# Altium schematic sheet MCU023_Hardware.SchDoc
size 431 x 279 mm; Date: Not shown in title block; ApprovedBy: Not shown in title block; CheckedBy: Not shown in title block; Author: Not shown in title block; CompanyName: Not shown in title block; Engineer: Not shown in title block; Organization: Not shown in title block; Address1: Not shown in title block; Address2: Not shown in title block; Address3: Not shown in title block; Address4: Not shown in title block; DocumentNumber: 1; Revision: Use project parameter SCH_Rev; SheetNumber: 6; SheetTotal: 6; PageSetup: Record=PageOptions|CenterHorizontal=True|CenterVertical=True|PrintScale=1.00|XCorrection=1.00|YCorrection=1.00|PrintKind=0|BorderSize=5000000|LeftOffset=0|BottomOffset=0|Orientation=2|PaperLength=1000|PaperWidth=1000|Scale=100|PaperSource=15|PrintQuality=600|MediaType=1|DitherType=10|PaperKind=Letter|PrintScaleMode=1; CurrentTime: Not shown in title block; CurrentDate: Not shown in title block; Time: Not shown in title block; DocumentFullPathAndName: Not shown in title block; DocumentName: Not shown in title block; ModifiedDate: Not shown in title block; ImagePath: Not shown in title block
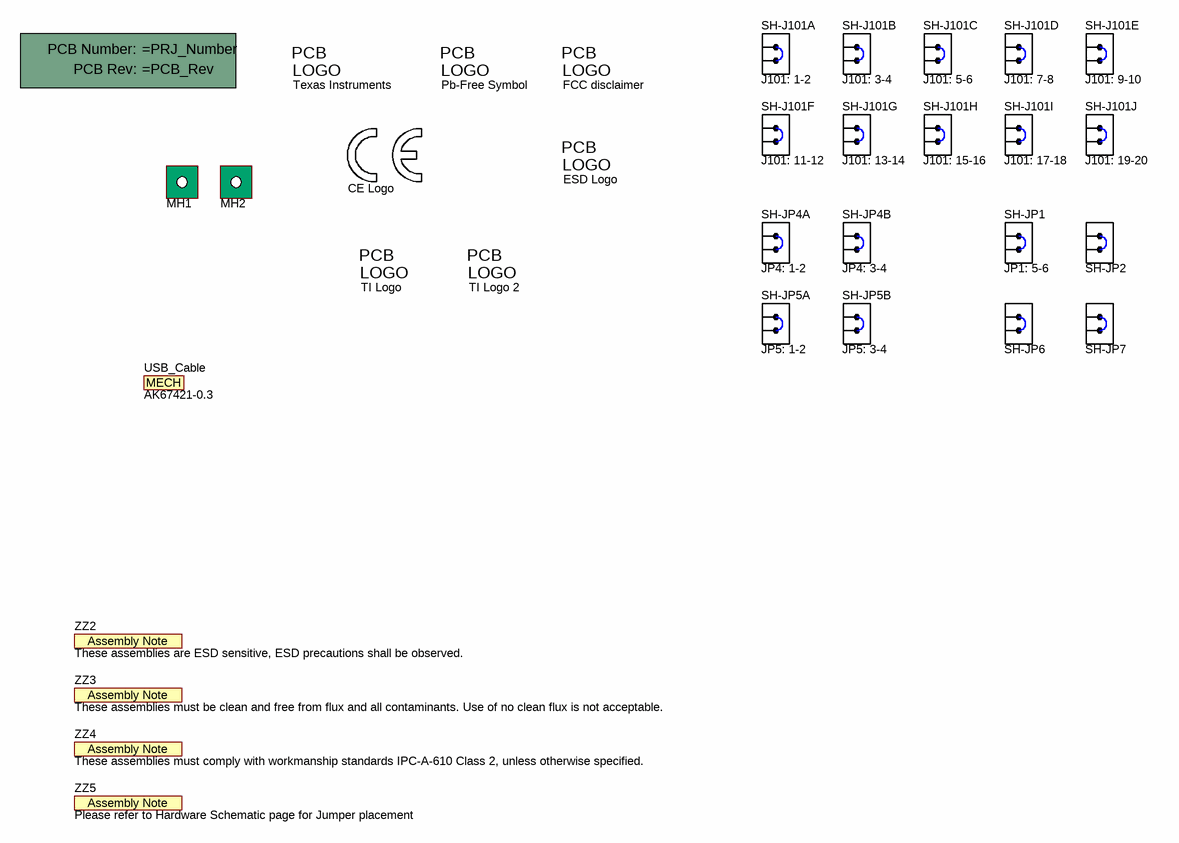
[diagram p0: MCU023_Hardware.SchDoc]

## Parts
!PCB  Printed Circuit Board  (value not drawn)  (mechanical)
CE_Logo  CE Mark  [CE_Mark_5mm]  (value not drawn)  (no BOM)
ESD_Logo  ESD Susceptible  [ESD_Overlay_Medium]  (value not drawn)  (no BOM)
Logo1  Texas Instruments  [TI_Stacked_Overlay_Small]  (no BOM)
Logo2  Pb-Free Symbol  [Pb-Free_Overlay_Medium]  (no BOM)
Logo3  FCC disclaimer  [FCC_disclaimer]  (no BOM)
MH1  MTG_NoPads  [NPTH125mil]  (value not drawn)  (no BOM)
MH2  MTG_NoPads  [NPTH125mil]  (value not drawn)  (no BOM)
SH-J101A  Note: J101: 1-2  [SNT-100-BK-G]  (hidden comment: SNT-100-BK-G)
SH-J101B  Note: J101: 3-4  [SNT-100-BK-G]  (hidden comment: SNT-100-BK-G)
SH-J101C  Note: J101: 5-6  [SNT-100-BK-G]  (hidden comment: SNT-100-BK-G)
SH-J101D  Note: J101: 7-8  [SNT-100-BK-G]  (hidden comment: SNT-100-BK-G)
SH-J101E  Note: J101: 9-10  [SNT-100-BK-G]  (hidden comment: SNT-100-BK-G)
SH-J101F  Note: J101: 11-12  [SNT-100-BK-G]  (hidden comment: SNT-100-BK-G)
SH-J101G  Note: J101: 13-14  [SNT-100-BK-G]  (hidden comment: SNT-100-BK-G)
SH-J101H  Note: J101: 15-16  [SNT-100-BK-G]  (hidden comment: SNT-100-BK-G)
SH-J101I  Note: J101: 17-18  [SNT-100-BK-G]  (hidden comment: SNT-100-BK-G)
SH-J101J  Note: J101: 19-20  [SNT-100-BK-G]  (hidden comment: SNT-100-BK-G)
SH-JP1  Note: JP1: 5-6  [SNT-100-BK-G]  (hidden comment: SNT-100-BK-G)
SH-JP2  SNT-100-BK-G  [SNT-100-BK-G]  (value not drawn)
SH-JP4A  Note: JP4: 1-2  [SNT-100-BK-G]  (hidden comment: SNT-100-BK-G)
SH-JP4B  Note: JP4: 3-4  [SNT-100-BK-G]  (hidden comment: SNT-100-BK-G)
SH-JP5A  Note: JP5: 1-2  [SNT-100-BK-G]  (hidden comment: SNT-100-BK-G)
SH-JP5B  Note: JP5: 3-4  [SNT-100-BK-G]  (hidden comment: SNT-100-BK-G)
SH-JP6  SNT-100-BK-G  [SNT-100-BK-G]  (value not drawn)
SH-JP7  SNT-100-BK-G  [SNT-100-BK-G]  (value not drawn)
TI_Logo  Texas Instruments  [TI_Symbol_Overlay_Medium]  (value not drawn)  (no BOM)
TI_Logo_2  Texas Instruments  [TI_Horizontal_Overlay_Small]  (value not drawn)  (no BOM)
USB_Cable  AK67421-0.3  (mechanical)
ZZ2  These assemblies are ESD sensitive, ESD precautions shall be observed.  [AssemblyNote]  (no BOM)
ZZ3  These assemblies must be clean and free from flux and all contaminants. Use of no clean flux is not acceptable.  [AssemblyNote]  (no BOM)
ZZ4  These assemblies must comply with workmanship standards IPC-A-610 Class 2, unless otherwise specified.  [AssemblyNote]  (no BOM)
ZZ5  Please refer to Hardware Schematic page for Jumper placement  [AssemblyNote]  (no BOM)

## Notes on the sheet
- Drawn By:
- SVN Rev:
- Number:
- TID #:
- Orderable:
- Rev:
- Sheet Title:
- File:
- Project Title:
- Designed for:
- Assembly Variant:
- Mod. Date:
- Sheet:
- Size:
- of
- B
- http://www.ti.com
- Texas Instruments and/or its licensors do not warrant the accuracy or completeness of this specification or any information contained therein. Texas Instruments and/or its licensors do not warrant that this design will meet the specifications, will be suitable for your application or fit for any particular purpose, or will operate in an implementation. Texas Instruments and/or its licensors do not warrant that the design is production worthy. You should completely validate and test your design implementation to confirm the system functionality for your application.
- Engineer:
- Contact:
- © Texas Instruments
- (in symbol AssemblyNote) Assembly Note
- (in symbol CMP-0077983-1) MECH
- (in symbol ESD_Susceptible) PCB; LOGO
- (in symbol FCC_disclaimer) PCB; LOGO
- (in symbol Pb-Free) PCB; LOGO
- (in symbol PCB) PCB Number:; PCB Rev:
- (in symbol TI_Logo) PCB; LOGO

## Library data of the parts
!PCB = PCB: Manufacturer: Any; SymbolCreator: a0412235; SymbolVersion: 2012-05-30; CompType: PCB; PartNumber: =PRJ_Number; RoHS: O; MountType: N/A; Publisher: Texas Instruments; LatestRevisionDate: 2012-06-27; LatestRevisionNote: Initial Version; Alternate Manufacturer: -; Alternate PartNumber: -
CE_Logo = CE Mark: SymbolCreator: a0412235; SymbolVersion: 2014-07-08; Published: 2009-03-03; Publisher: Texas Instruments; LatestRevisionDate: 2016-03-21
ESD_Logo = ESD_Susceptible: ESD Susceptible Symbol; SymbolCreator: a0412235; SymbolVersion: 2011-08-22; Published: 2009-03-03; Publisher: Texas Instruments; LatestRevisionDate: 2016-03-21
Logo1 = TI_Logo: Texas Instrument Corporate Signature; SymbolCreator: codlsc; SymbolVersion: 2011-08-22; Published: 2009-03-03; Publisher: National Semiconductor; ClassName: Logo; LatestRevisionDate: 2011-10-25; LatestRevisionNote: Added ClassName of Logo.
Logo2 = Pb-Free: SymbolCreator: a0412235; SymbolVersion: 2011-08-22; Published: 2009-03-03; Publisher: Texas Instruments; LatestRevisionDate: 2014-08-05
Logo3 = FCC_disclaimer: SymbolCreator: codlsc; SymbolVersion: 2011-08-22; Published: 2009-03-03; Publisher: Texas Instruments; LatestRevisionDate: 2014-11-20
MH1 MH2 = Mounting Hole (non-standard) No Pad: PCB Mounting Hole, No Pad; Manufacturer: Any; SymbolCreator: a0412235; SymbolVersion: 2013-12-26; CompType: Mounting Hole; PartNumber: N/A; PackageReference: Mounting Hole; MountType: N/A; Publisher: Texas Instruments; LatestRevisionDate: 2017-01-25
SH-J101A SH-J101B SH-J101C SH-J101D SH-J101E SH-J101F SH-J101G SH-J101H SH-J101I SH-J101J SH-JP1 SH-JP4A SH-JP4B SH-JP5A SH-JP5B = SNT-100-BK-G: Shunt, 100mil, Gold plated, Black; Manufacturer: Samtec; Alternate Manufacturer: 3M; Alternate PartNumber: 969102-0000-DA; Value: 1x2; Green_Lifecycle: Active; Green_REACh: Passed; ClassName: Shunt; CompType: Shunt; PartNumber: SNT-100-BK-G; RoHS: Y; PackageReference: Shunt; MountType: N/A; ComponentLink1Description: Datasheet Link; ComponentLink1URL: http://www.samtec.com/ftppub/pdf/SNT.PDF; Publisher: Texas Instruments; LatestRevisionDate: 2017-06-22; Supplier 1: Digi-Key; Supplier Part Number 1: SNT-100-BK-G-ND; Green_EU RoHS: Passed; Green_EU RoHS-2: Passed
SH-JP2 = SNT-100-BK-G: Shunt, 100mil, Gold plated, Black; Manufacturer: Samtec; Alternate Manufacturer: 3M; Alternate PartNumber: 969102-0000-DA; Value: 1x2; Note: JP2: 1-2; Green_Lifecycle: Active; Green_REACh: Passed; ClassName: Shunt; CompType: Shunt; PartNumber: SNT-100-BK-G; RoHS: Y; PackageReference: Shunt; MountType: N/A; ComponentLink1Description: Datasheet Link; ComponentLink1URL: http://www.samtec.com/ftppub/pdf/SNT.PDF; Publisher: Texas Instruments; LatestRevisionDate: 2017-06-22; Supplier 1: Digi-Key; Supplier Part Number 1: SNT-100-BK-G-ND; Green_EU RoHS: Passed; Green_EU RoHS-2: Passed
SH-JP6 = SNT-100-BK-G: Shunt, 100mil, Gold plated, Black; Manufacturer: Samtec; Alternate Manufacturer: 3M; Alternate PartNumber: 969102-0000-DA; Value: 1x2; Note: JP6: 1-2; Green_Lifecycle: Active; Green_REACh: Passed; ClassName: Shunt; CompType: Shunt; PartNumber: SNT-100-BK-G; RoHS: Y; PackageReference: Shunt; MountType: N/A; ComponentLink1Description: Datasheet Link; ComponentLink1URL: http://www.samtec.com/ftppub/pdf/SNT.PDF; Publisher: Texas Instruments; LatestRevisionDate: 2017-06-22; Supplier 1: Digi-Key; Supplier Part Number 1: SNT-100-BK-G-ND; Green_EU RoHS: Passed; Green_EU RoHS-2: Passed
SH-JP7 = SNT-100-BK-G: Shunt, 100mil, Gold plated, Black; Manufacturer: Samtec; Alternate Manufacturer: 3M; Alternate PartNumber: 969102-0000-DA; Value: 1x2; Note: JP7: 1-2; Green_Lifecycle: Active; Green_REACh: Passed; ClassName: Shunt; CompType: Shunt; PartNumber: SNT-100-BK-G; RoHS: Y; PackageReference: Shunt; MountType: N/A; ComponentLink1Description: Datasheet Link; ComponentLink1URL: http://www.samtec.com/ftppub/pdf/SNT.PDF; Publisher: Texas Instruments; LatestRevisionDate: 2017-06-22; Supplier 1: Digi-Key; Supplier Part Number 1: SNT-100-BK-G-ND; Green_EU RoHS: Passed; Green_EU RoHS-2: Passed
TI_Logo TI_Logo_2 = TI_Logo: Texas Instrument Corporate Signature; SymbolCreator: a0412235; SymbolVersion: 2011-08-22; ClassName: Logo; Published: 2009-03-03; Publisher: Texas Instruments; LatestRevisionDate: 2016-03-21
USB_Cable = CMP-0077983-1: Cable, USB-A to micro USB-B, 0.3 m; Manufacturer: Assman WSW; ComponentLink1URL: http://www.assmann-wsw.com/fileadmin/datasheets/ASS_7091_CA.pdf; Key: AK67421-0.3; CompType: Cable; Supplier 1: Digi-Key; RoHS: Y; Supplier Part Number 1: AE11229-ND; PartNumber: AK67421-0.3; MountType: N/A; ComponentLink1Description: Datasheet Link
ZZ2-ZZ4 = AssemblyNote: SymbolCreator: codlsc; SymbolVersion: 2010-05-18; CompType: AssemblyNote; ClassName: AssemblyNote; Publisher: Texas Instruments; LatestRevisionDate: 2012-06-14; LatestRevisionNote: Initial Version; Alternate Manufacturer: -; Alternate PartNumber: -
ZZ5 = AssemblyNote: These assemblies must comply with workmanship standards IPC-A-610 Class 2, unless otherwise specified.; SymbolCreator: codlsc; SymbolVersion: 2010-05-18; CompType: AssemblyNote; ClassName: AssemblyNote; Publisher: Texas Instruments; LatestRevisionDate: 2012-06-14; LatestRevisionNote: Initial Version; Alternate Manufacturer: -; Alternate PartNumber: -